# Altium schematic sheet Sheet_Top_Back.SchDoc: Sheet_Top_Back
size A4; Organization: Altium Limited; Address1: L3, 12a Rodborough Rd; Address2: Frenchs Forest; Address3: NSW; Address4: Australia 2086
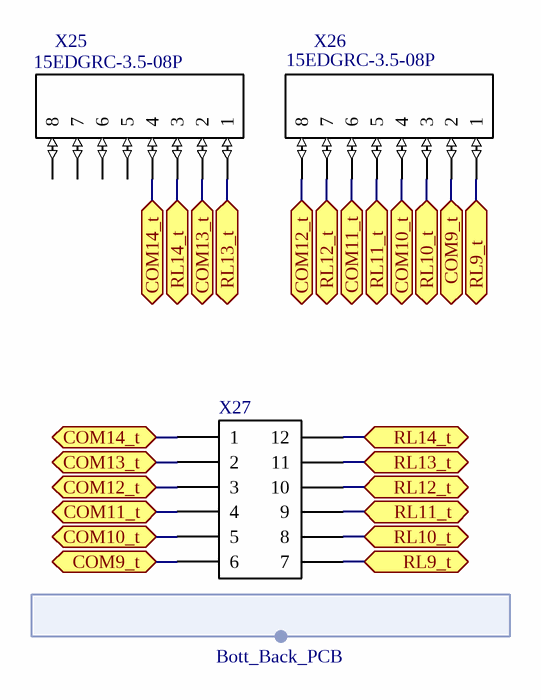
[diagram p0: Sheet_Top_Back.SchDoc]

## Parts
X25  15EDGRC-3.5-08P  [MC_3.5_8]
X26  15EDGRC-3.5-08P  [MC_3.5_8]
X27  PBS2-12  [PLS2-12]  (value not drawn)

## Ports
COM9_t, COM10_t, COM11_t, COM12_t, COM13_t, COM14_t, RL9_t, RL10_t, RL11_t, RL12_t, RL13_t, RL14_t

## Harnesses
Bott_Back_PCB: 

## Nets
COM9_t: X26.2 X27.6 ; port COM9_t
COM10_t: X26.4 X27.5 ; port COM10_t
COM11_t: X26.6 X27.4 ; port COM11_t
COM12_t: X26.8 X27.3 ; port COM12_t
COM13_t: X25.2 X27.2 ; port COM13_t
COM14_t: X25.4 X27.1 ; port COM14_t
RL9_t: X26.1 X27.7 ; port RL9_t
RL10_t: X26.3 X27.8 ; port RL10_t
RL11_t: X26.5 X27.9 ; port RL11_t
RL12_t: X26.7 X27.10 ; port RL12_t
RL13_t: X25.1 X27.11 ; port RL13_t
RL14_t: X25.3 X27.12 ; port RL14_t

Not connected (* = marked no-connect by the designer): X25 5 6 7 8

## Notes on the sheet
- Title
- Size:
- Date:
- A4
- Number:
- Time:
- Revision:
- Sheet
- of
- File:

## Library data of the parts
X25 X26 = MC_3.5_8: Connector 3.5mm
X27 = PLS2-12: Header, 12-Pin